# Altium schematic sheet PA stage 2.SchDoc
size A; SheetNumber: 9; SheetTotal: 12
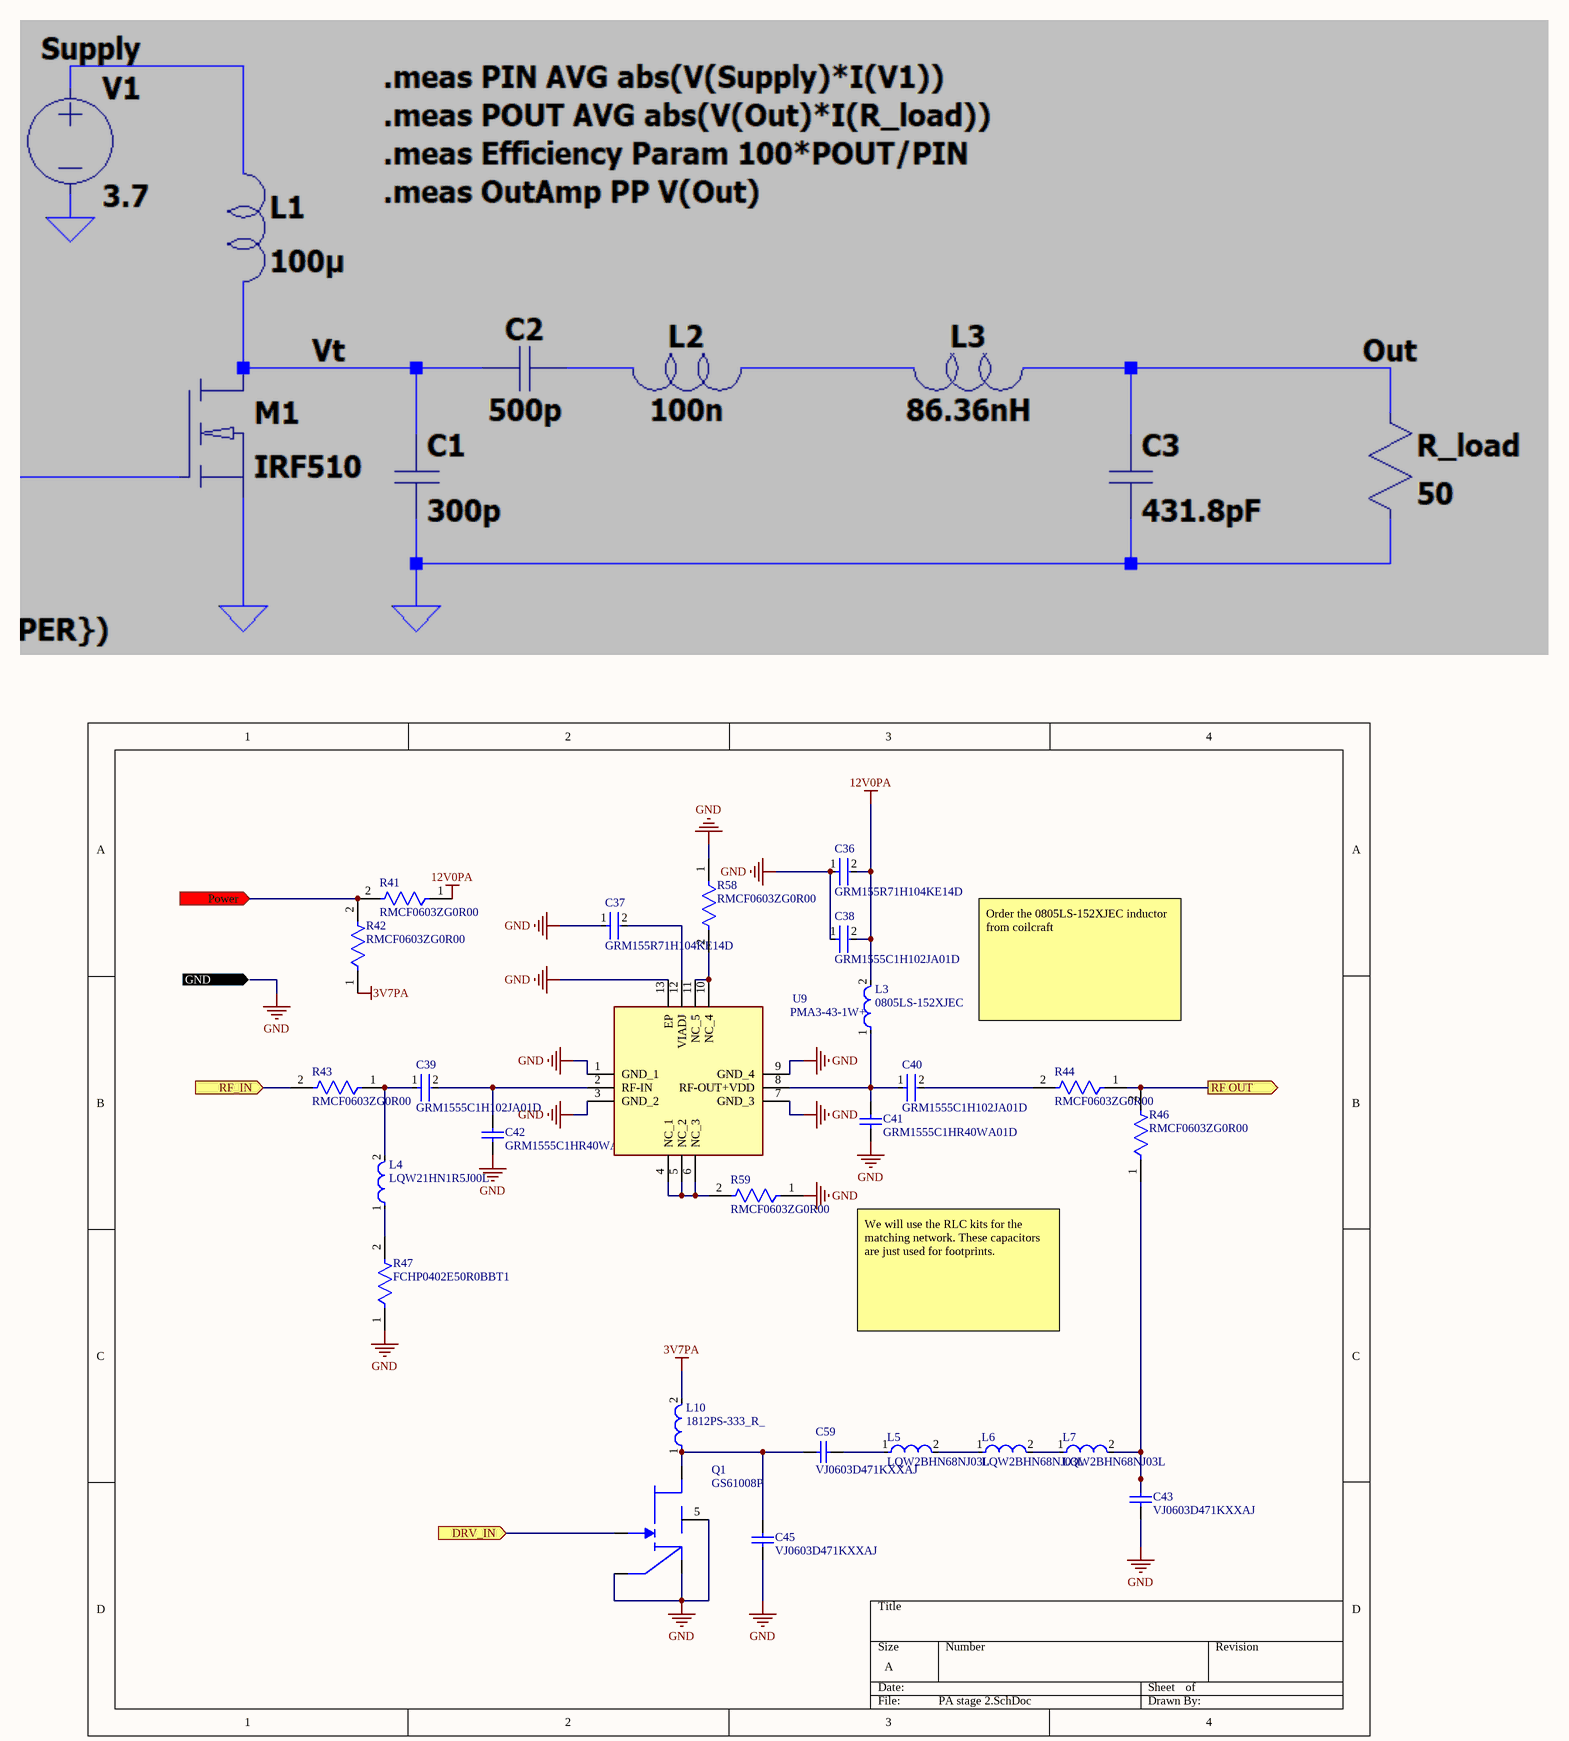
[diagram p0: PA stage 2.SchDoc]

## Parts
C36  GRM155R71H104KE14D  [FP-GRM155-0_05-IPC_B]
C37  GRM155R71H104KE14D  [FP-GRM155-0_05-IPC_B]
C38  GRM1555C1H102JA01D  [FP-GRM155-0_05-IPC_B]
C39  GRM1555C1H102JA01D  [FP-GRM155-0_05-IPC_B]
C40  GRM1555C1H102JA01D  [FP-GRM155-0_05-IPC_B]
C41  GRM1555C1HR40WA01D  [CAPC1005X55X25LL05T10]
C42  GRM1555C1HR40WA01D  [CAPC1005X55X25LL05T10]
C43  VJ0603D471KXXAJ  [CAPC1608X92X38LL15T08]
C45  VJ0603D471KXXAJ  [CAPC1608X92X38LL15T08]
C59  VJ0603D471KXXAJ  [CAPC1608X92X38LL15T08]
L3  0805LS-152XJEC  [FP-LQW21HN_00-MFG]
L4  LQW21HN1R5J00L  [FP-LQW21HN_00-MFG]
L5  LQW2BHN68NJ03L  [FP-LQW2BHN_03-MFG]
L6  LQW2BHN68NJ03L  [FP-LQW2BHN_03-MFG]
L7  LQW2BHN68NJ03L  [FP-LQW2BHN_03-MFG]
L10  1812PS-333_R_  [FP-1812PS-MFG]
Q1  GS61008P  [TRANS_GS61008P]
R41  RMCF0603ZG0R00  [FP-RMCF0603-IPC_B]
R42  RMCF0603ZG0R00  [FP-RMCF0603-IPC_B]
R43  RMCF0603ZG0R00  [FP-RMCF0603-IPC_B]
R44  RMCF0603ZG0R00  [FP-RMCF0603-IPC_B]
R46  RMCF0603ZG0R00  [FP-RMCF0603-IPC_B]
R47  FCHP0402E50R0BBT1  [FP-FC0402-MFG]
R58  RMCF0603ZG0R00  [FP-RMCF0603-IPC_B]
R59  RMCF0603ZG0R00  [FP-RMCF0603-IPC_B]
U9  PMA3-43-1W+  [QFN51P300X300X89-13N]

## Ports
DRV_IN (in), GND (in), Power (in), RF OUT (out), RF_IN (in)

## Nets
3V7PA: L10.2 R42.1
12V0PA: C36.2 C38.2 L3.2 R41.1
GND: C36.1 C37.1 C38.1 C41.1 C42.1 C43.1 C45.1 Q1.3(SS) Q1.4(S) Q1.5(THERMAL_PAD) R47.1 R58.1 R59.1 U9.1(GND_1) U9.3(GND_2) U9.7(GND_3) U9.9(GND_4) U9.13(EP) ; port GND
DRV_IN: Q1.2(G) ; port DRV_IN
Power: R41.2 R42.2 ; port Power
RF OUT: R44.1 R46.2 ; port RF OUT
RF_IN: R43.2 ; port RF_IN
NetC37_2: C37.2 U9.12(VIADJ)
NetC39_1: C39.1 L4.2 R43.1
NetC39_2: C39.2 C42.2 U9.2(RF-IN)
NetC40_1: C40.1 C41.2 L3.1 U9.8(RF-OUT+VDD)
NetC40_2: C40.2 R44.2
NetC43_2: C43.2 L7.2 R46.1
NetC45_2: C45.2 C59.2 L10.1 Q1.1(D)
NetC59_1: C59.1 L5.1
NetL4_1: L4.1 R47.2
NetL5_2: L5.2 L6.1
NetL6_2: L6.2 L7.1
NetR58_2: R58.2 U9.10(NC_4) U9.11(NC_5)
NetR59_2: R59.2 U9.4(NC_1) U9.5(NC_2) U9.6(NC_3)

## Notes on the sheet
- Order the 0805LS-152XJEC inductor from coilcraft
- We will use the RLC kits for the matching network. These capacitors are just used for footprints.

## Library data of the parts
C36 C37 = CMP-2008-04639-2: Chip Multilayer Ceramic Capacitors for General Purpose, 0402, 0.10uF, X7R, 15%, 10%, 50V; Dissipation Factor: 0.025%; Capacitance: 100nF; Weight: 0.000212oz; Thickness: 0.022inch; Voltage Rating (DC): 50V; Dielectric Material: Ceramic; Termination: SMD/SMT; Case/Package: 0402; Case Code (Imperial): 0402; Mount: Surface Mount; REACH SVHC: No SVHC; Resistor Type: Ceramic; Dielectric: X7R; Max Operating Temperature: 125°C; Voltage: 50V; Lead Free: Lead Free; Package Quantity: 10000; Packaging: Tape and Reel; Length: 1mm; Material: Ceramic; Height: 0.5mm; Depth: 0.5mm; Width: 0.5mm; Min Operating Temperature: -55°C; Tolerance: 10%; Case Code (Metric): 1005; Voltage Rating: 50V
C38-C40 = CMP-2008-04254-2: Chip Multilayer Ceramic Capacitors for General Purpose, 0402, 1000pF, C0G, 30ppm/°C, 5%, 50V; Insulation Resistance: 10GR; Capacitance: 1nF; Packaging: Tape and Reel; Lead Free: Lead Free; Tolerance: 5%; Temperature Coefficient: 30ppm/°C; Thickness: 0.022inch; Termination: SMD/SMT; Max Operating Temperature: 125°C; Height: 0.5mm; Package Quantity: 1; Radiation Hardening: No; Material: Ceramic; Case Code (Metric): 1005; Number of Pins: 2; Voltage Rating: 50V; Mount: Surface Mount; Voltage: 50V; Case/Package: 0402; Min Operating Temperature: -55°C; Dielectric Material: Ceramic; Width: 0.5mm; Depth: 0.5mm; Case Code (Imperial): 0402; REACH SVHC: No SVHC; Dielectric: C0G; Voltage Rating (DC): 50V; Length: 1mm
C41 C42 = CMP-1034-00010-2: Manufacturer: Murata; Part Number: GRM1555C1HR40WA01D
C43 C45 C59 = CMP-2006-01521-1: Manufacturer: Vitramon; Part Number: VJ0603D471KXXAJ
L3 = CMP-06042-001639-1: 0805LS-152XJEC Coilcraft; Core Material: Ferrite; DC Current: 85mA; DC Resistance (DCR): 5.33R; Self Resonant Frequency: 350MHz; Shielding: Unshielded; Inductance: 1.5uH; Test Frequency: 10MHz; Tolerance: 5%; Q Factor: 35; Width: 0.047inch; Case Code (Metric): 2012; Current Rating: 85mA; Mount: Surface Mount; Max DC Current: 85mA; Length: 2mm; Height - Seated (Max): 0.039inch; Depth: 1.4mm; Min Operating Temperature: -40°C; Termination: SMD/SMT; Military Standard: Not; Radiation Hardening: No; Packaging: Tape and Reel; Resistor Type: Wirewound; Case/Package: 0805; Case Code (Imperial): 0805; Weight: 0.000282oz; Height: 0.9mm; Package Quantity: 3000; Max Operating Temperature: 85°C
L4 = CMP-06042-001639-1: Wire Wound Ferrite type RF Inuctor 1.5uH ±5% 85mA 5.33Ω 0805 (2012); DC Resistance (DCR): 5.33R; Self Resonant Frequency: 350MHz; Shielding: Unshielded; Test Frequency: 10MHz; Q Factor: 35; Width: 0.047inch; Core Material: Ferrite; Case Code (Metric): 2012; DC Current: 85mA; Current Rating: 85mA; Mount: Surface Mount; Max DC Current: 85mA; Length: 2mm; Height - Seated (Max): 0.039inch; Depth: 1.4mm; Min Operating Temperature: -40°C; Termination: SMD/SMT; Military Standard: Not; Radiation Hardening: No; Packaging: Tape and Reel; Resistor Type: Wirewound; Case/Package: 0805; Case Code (Imperial): 0805; Inductance: 1.5uH; Weight: 0.000282oz; Height: 0.9mm; Package Quantity: 3000; Max Operating Temperature: 85°C; Tolerance: 5%
L5-L7 = CMP-06042-008671-1: Wire Wound RF Inductor 68nH ±5% 460mA 0.23Ω 0805 (2015); Shielding: Unshielded; DC Resistance (DCR): 230mR; Q Factor: 40; Test Frequency: 100MHz; Self Resonant Frequency: 1.2GHz; Core Material: Non-Magnetic; Depth: 1.7mm; Height - Seated (Max): 0.07inch; Case/Package: 0805; Min Operating Temperature: -40°C; Package Quantity: 2000; Weight: 0.000317oz; Max Operating Temperature: 85°C; Width: 0.059inch; Length: 2.2mm; DC Current: 460mA; Current Rating: 460mA; Radiation Hardening: No; Termination: SMD/SMT; Case Code (Metric): 2015; Max DC Current: 460mA; Mount: Surface Mount; Military Standard: Not; Inductance: 68nH; Tolerance: 5%; Packaging: Tape and Reel; Resistor Type: Wirewound; Height: 1.7mm; Case Code (Imperial): 0805
L10 = CMP-11268-000188-1: 1812PS-333_R_ Coilcraft; Core Material: Ferrite; Test Frequency: 100kHz; DC Resistance (DCR): 170mR; Inductance: 10uH; Self Resonant Frequency: 120MHz; Q Factor: 40; Shielding: Shielded; Tolerance: 5%; Max DC Current: 1.7A; Height: 3.81mm; Length: 5.87mm; Case/Package: 1812; Series: 1812PS; Packaging: Tape and Reel; Package Quantity: 600; Width: 4.98mm; Max Operating Temperature: 105°C; Termination: SMD/SMT; Lead Free: Contains Lead; Min Operating Temperature: -40°C; RoHS Compliant: Yes
Q1 = GS61008P: Top cooled 100V enhancement mode GaN transistor; MF: GaN Systems; Check_prices: https://www.snapeda.com/parts/GS61008P/GaN%20Systems/view-part/106624/?ref=eda; Availability: In Stock; Price: None; Package: DFN-5 GaN Systems; Value: *; SnapEDA_Link: https://www.snapeda.com/parts/GS61008P/GaN%20Systems/view-part/106624/?ref=snap; Purchase-URL: https://pricing.snapeda.com/search/part/GS61008P/?ref=eda; MP: GS61008P
R41-R44 R46 R58 R59 = CMP-26527-006412-1: 0Ω ±0 0.1W 0603 Thick Film Chip Resistor AEC-Q200 compliant; Max Power Dissipation: 100mW; Resistance: 0R; Width: 0.031inch; RoHS Compliant: Yes; Number of Terminations: 2; Case/Package: 0603; Contact Plating: Tin; Height: 0.022inch; Resistor Type: Thick Film; Mount: Surface Mount; Length: 0.061inch; Features: Automotive AEC-Q200; Series: RMCF; Max Operating Temperature: 155°C; Radiation Hardening: No; Min Operating Temperature: -55°C; Packaging: Tape and Reel
R47 = CMP-05494-120702529-1: FCHP0402E50R0BBT1 SMD Chip Resistor, 50 Ohm, ± 0.1%, 1 W, 0402 [1005 Metric], Thin Film, High Frequency; Power Rating: 1W; Voltage Rating: 30V; Temperature Coefficient: 25ppm/°C; Resistance: 50Ω; Max Operating Temperature: 155°C; Min Operating Temperature: -55°C; Composition: Thin Film; Schedule B: 8533210045; Case/Package: 0402; Tolerance: 0.1%; Height: 419.1µm; NexarPartId: 120702529
U9 = PMA3-43-1W+: Integrated Circuit; Manufacturer_Name: Mini-Circuits; Datasheet Link: https://www.minicircuits.com/pdfs/PMA3-43-1W+.pdf; Height: 0.89mm; Manufacturer_Part_Number: PMA3-43-1W+